# EAGLE design LED-zero35-SHIM (EAGLE 9.6.2)

## Sheet 1 of 2
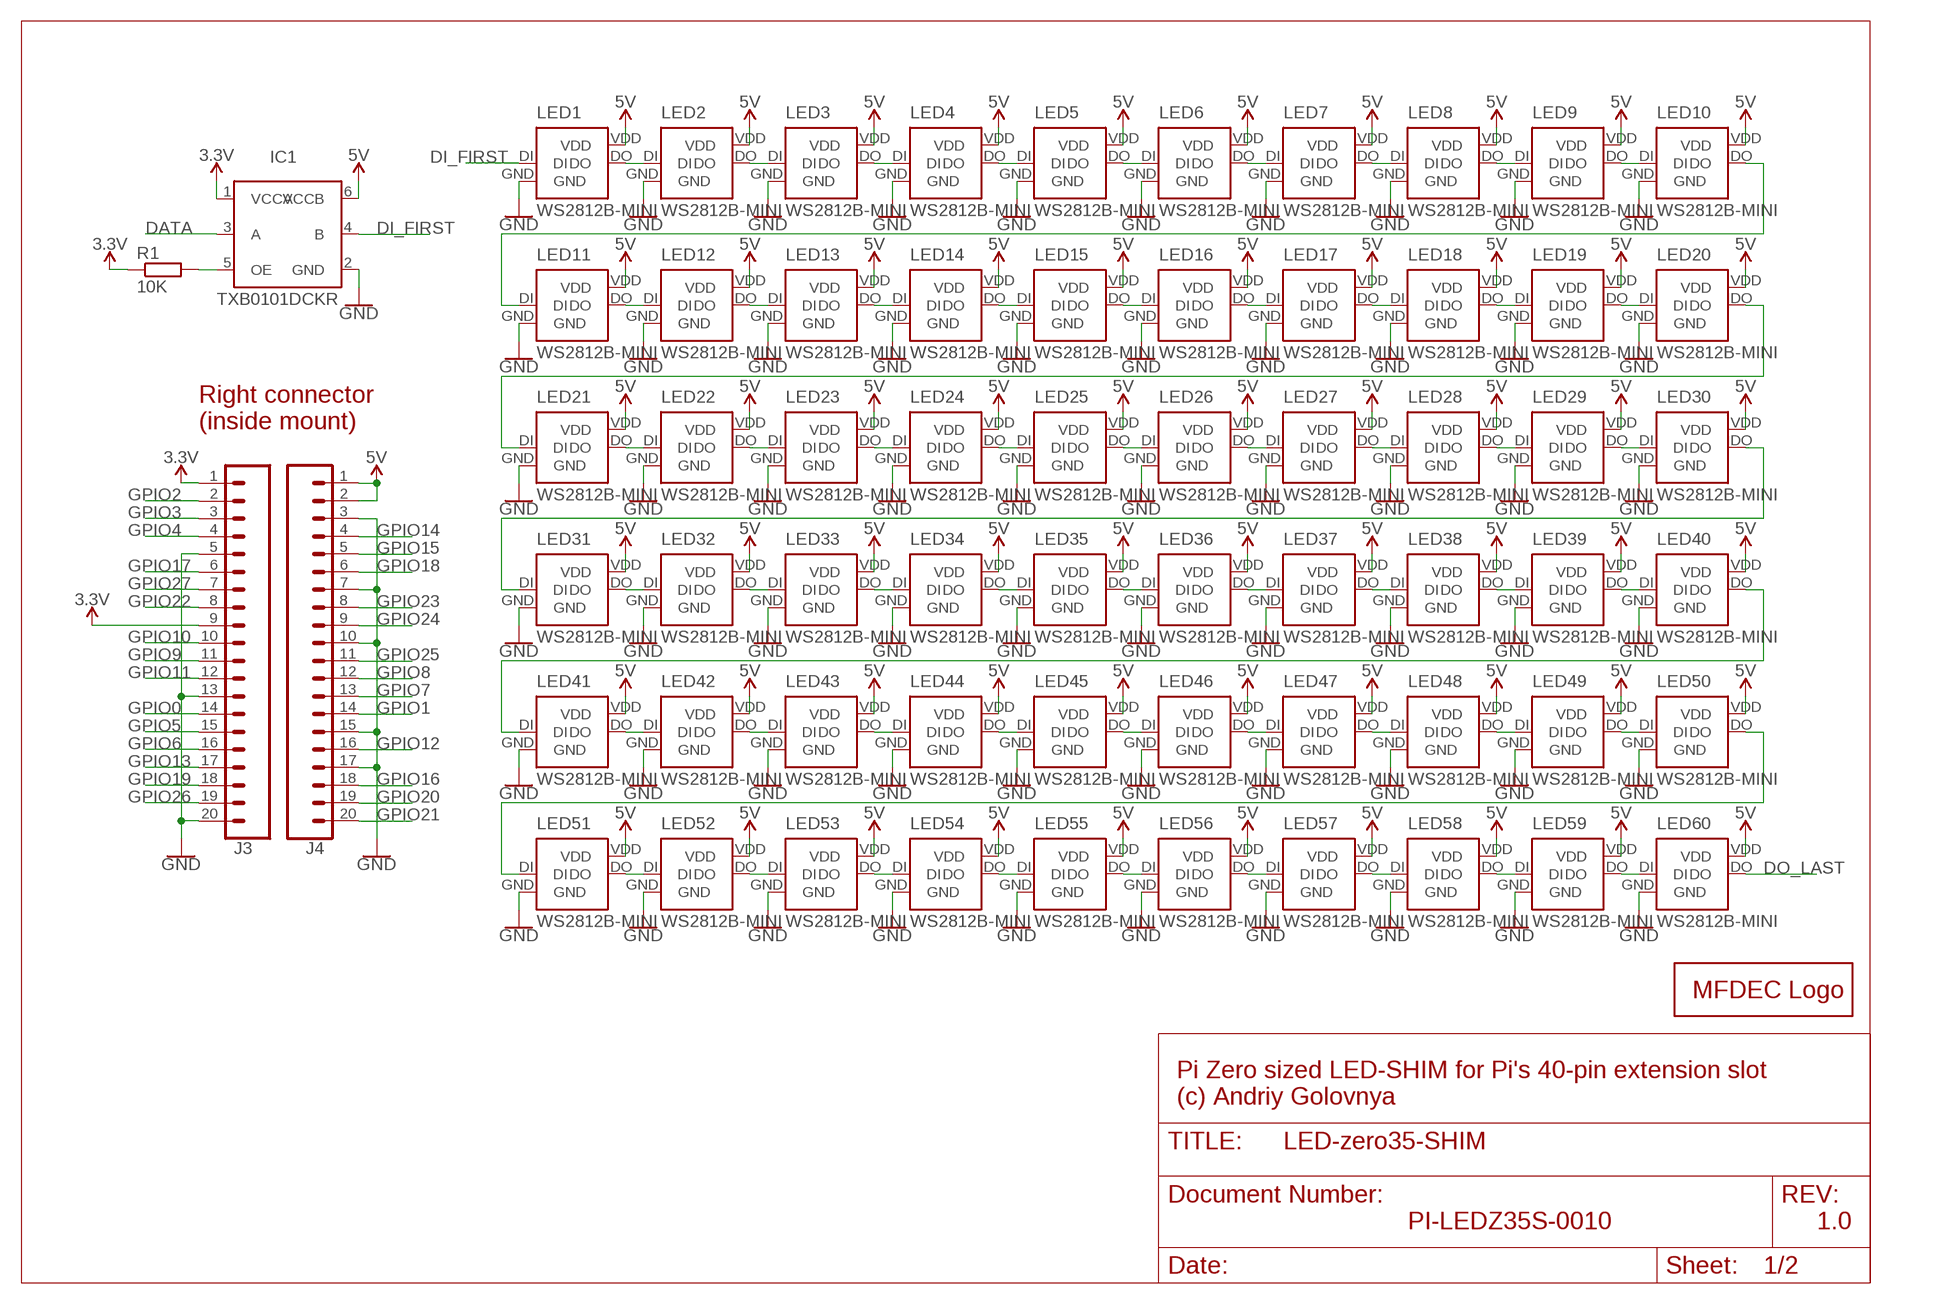
[diagram p0: schematic, sheet 1]

### Parts
IC1  TXB0101DCKR  [SOT65P210X110-6N]
J3  CONN_20LOCK  [1X20_LOCK]
J4  CONN_20LOCK  [1X20_LOCK]
LED1  WS2812B-MINI  [WS2812X-MINI]
LED2  WS2812B-MINI  [WS2812X-MINI]
LED3  WS2812B-MINI  [WS2812X-MINI]
LED4  WS2812B-MINI  [WS2812X-MINI]
LED5  WS2812B-MINI  [WS2812X-MINI]
LED6  WS2812B-MINI  [WS2812X-MINI]
LED7  WS2812B-MINI  [WS2812X-MINI]
LED8  WS2812B-MINI  [WS2812X-MINI]
LED9  WS2812B-MINI  [WS2812X-MINI]
LED10  WS2812B-MINI  [WS2812X-MINI]
LED11  WS2812B-MINI  [WS2812X-MINI]
LED12  WS2812B-MINI  [WS2812X-MINI]
LED13  WS2812B-MINI  [WS2812X-MINI]
LED14  WS2812B-MINI  [WS2812X-MINI]
LED15  WS2812B-MINI  [WS2812X-MINI]
LED16  WS2812B-MINI  [WS2812X-MINI]
LED17  WS2812B-MINI  [WS2812X-MINI]
LED18  WS2812B-MINI  [WS2812X-MINI]
LED19  WS2812B-MINI  [WS2812X-MINI]
LED20  WS2812B-MINI  [WS2812X-MINI]
LED21  WS2812B-MINI  [WS2812X-MINI]
LED22  WS2812B-MINI  [WS2812X-MINI]
LED23  WS2812B-MINI  [WS2812X-MINI]
LED24  WS2812B-MINI  [WS2812X-MINI]
LED25  WS2812B-MINI  [WS2812X-MINI]
LED26  WS2812B-MINI  [WS2812X-MINI]
LED27  WS2812B-MINI  [WS2812X-MINI]
LED28  WS2812B-MINI  [WS2812X-MINI]
LED29  WS2812B-MINI  [WS2812X-MINI]
LED30  WS2812B-MINI  [WS2812X-MINI]
LED31  WS2812B-MINI  [WS2812X-MINI]
LED32  WS2812B-MINI  [WS2812X-MINI]
LED33  WS2812B-MINI  [WS2812X-MINI]
LED34  WS2812B-MINI  [WS2812X-MINI]
LED35  WS2812B-MINI  [WS2812X-MINI]
LED36  WS2812B-MINI  [WS2812X-MINI]
LED37  WS2812B-MINI  [WS2812X-MINI]
LED38  WS2812B-MINI  [WS2812X-MINI]
LED39  WS2812B-MINI  [WS2812X-MINI]
LED40  WS2812B-MINI  [WS2812X-MINI]
LED41  WS2812B-MINI  [WS2812X-MINI]
LED42  WS2812B-MINI  [WS2812X-MINI]
LED43  WS2812B-MINI  [WS2812X-MINI]
LED44  WS2812B-MINI  [WS2812X-MINI]
LED45  WS2812B-MINI  [WS2812X-MINI]
LED46  WS2812B-MINI  [WS2812X-MINI]
LED47  WS2812B-MINI  [WS2812X-MINI]
LED48  WS2812B-MINI  [WS2812X-MINI]
LED49  WS2812B-MINI  [WS2812X-MINI]
LED50  WS2812B-MINI  [WS2812X-MINI]
LED51  WS2812B-MINI  [WS2812X-MINI]
LED52  WS2812B-MINI  [WS2812X-MINI]
LED53  WS2812B-MINI  [WS2812X-MINI]
LED54  WS2812B-MINI  [WS2812X-MINI]
LED55  WS2812B-MINI  [WS2812X-MINI]
LED56  WS2812B-MINI  [WS2812X-MINI]
LED57  WS2812B-MINI  [WS2812X-MINI]
LED58  WS2812B-MINI  [WS2812X-MINI]
LED59  WS2812B-MINI  [WS2812X-MINI]
LED60  WS2812B-MINI  [WS2812X-MINI]
LOGO1  MFDECLOGO_L_30MM  [MFDEC_L_30MM]
R1  10K  R-EU_R0402  [R0402]

### Nets
3.3V: IC1.1(VCCA) J3.1 J3.9 R1.1
5V: IC1.6(VCCB) J4.1 J4.2 LED1.VDD LED2.VDD LED3.VDD LED4.VDD LED5.VDD LED6.VDD LED7.VDD LED8.VDD LED9.VDD LED10.VDD LED11.VDD LED12.VDD LED13.VDD LED14.VDD LED15.VDD LED16.VDD LED17.VDD LED18.VDD LED19.VDD LED20.VDD LED21.VDD LED22.VDD LED23.VDD LED24.VDD LED25.VDD LED26.VDD LED27.VDD LED28.VDD LED29.VDD LED30.VDD LED31.VDD LED32.VDD LED33.VDD LED34.VDD LED35.VDD LED36.VDD LED37.VDD LED38.VDD LED39.VDD LED40.VDD LED41.VDD LED42.VDD LED43.VDD LED44.VDD LED45.VDD LED46.VDD LED47.VDD LED48.VDD LED49.VDD LED50.VDD LED51.VDD LED52.VDD LED53.VDD LED54.VDD LED55.VDD LED56.VDD LED57.VDD LED58.VDD LED59.VDD LED60.VDD ; also sheet 2
DATA: IC1.3(A) ; also sheet 2
DI_FIRST: IC1.4(B) LED1.DI ; also sheet 2
DO_LAST: LED60.DO ; also sheet 2
GND: IC1.2(GND) J3.5 J3.13 J3.20 J4.3 J4.7 J4.10 J4.15 J4.17 LED1.GND LED2.GND LED3.GND LED4.GND LED5.GND LED6.GND LED7.GND LED8.GND LED9.GND LED10.GND LED11.GND LED12.GND LED13.GND LED14.GND LED15.GND LED16.GND LED17.GND LED18.GND LED19.GND LED20.GND LED21.GND LED22.GND LED23.GND LED24.GND LED25.GND LED26.GND LED27.GND LED28.GND LED29.GND LED30.GND LED31.GND LED32.GND LED33.GND LED34.GND LED35.GND LED36.GND LED37.GND LED38.GND LED39.GND LED40.GND LED41.GND LED42.GND LED43.GND LED44.GND LED45.GND LED46.GND LED47.GND LED48.GND LED49.GND LED50.GND LED51.GND LED52.GND LED53.GND LED54.GND LED55.GND LED56.GND LED57.GND LED58.GND LED59.GND LED60.GND ; also sheet 2
GPIO0: J3.14
GPIO1: J4.14
GPIO2: J3.2
GPIO3: J3.3
GPIO4: J3.4
GPIO5: J3.15
GPIO6: J3.16
GPIO7: J4.13
GPIO8: J4.12
GPIO9: J3.11
GPIO10: J3.10 ; also sheet 2
GPIO11: J3.12
GPIO12: J4.16
GPIO13: J3.17
GPIO14: J4.4
GPIO15: J4.5
GPIO16: J4.18
GPIO17: J3.6
GPIO18: J4.6 ; also sheet 2
GPIO19: J3.18
GPIO20: J4.19
GPIO21: J4.20 ; also sheet 2
GPIO22: J3.8
GPIO23: J4.8
GPIO24: J4.9
GPIO25: J4.11
GPIO26: J3.19
GPIO27: J3.7
N$1: LED1.DO LED2.DI
N$2: LED2.DO LED3.DI
N$3: LED3.DO LED4.DI
N$4: LED4.DO LED5.DI
N$5: LED5.DO LED6.DI
N$6: LED6.DO LED7.DI
N$7: LED7.DO LED8.DI
N$8: LED8.DO LED9.DI
N$9: LED9.DO LED10.DI
N$10: LED10.DO LED11.DI
N$11: LED11.DO LED12.DI
N$12: LED12.DO LED13.DI
N$13: LED13.DO LED14.DI
N$14: LED14.DO LED15.DI
N$15: LED15.DO LED16.DI
N$16: LED16.DO LED17.DI
N$17: LED17.DO LED18.DI
N$18: LED18.DO LED19.DI
N$19: LED19.DO LED20.DI
N$20: LED20.DO LED21.DI
N$22: LED21.DO LED22.DI
N$23: LED22.DO LED23.DI
N$24: LED23.DO LED24.DI
N$25: LED24.DO LED25.DI
N$26: LED25.DO LED26.DI
N$27: LED26.DO LED27.DI
N$28: LED27.DO LED28.DI
N$29: LED28.DO LED29.DI
N$30: LED29.DO LED30.DI
N$31: LED30.DO LED31.DI
N$32: LED41.DO LED42.DI
N$33: LED31.DO LED32.DI
N$34: LED32.DO LED33.DI
N$35: LED33.DO LED34.DI
N$36: LED34.DO LED35.DI
N$37: LED35.DO LED36.DI
N$38: LED36.DO LED37.DI
N$39: LED37.DO LED38.DI
N$40: LED38.DO LED39.DI
N$41: LED39.DO LED40.DI
N$42: LED40.DO LED41.DI
N$43: LED42.DO LED43.DI
N$44: LED43.DO LED44.DI
N$45: LED44.DO LED45.DI
N$46: LED45.DO LED46.DI
N$47: LED46.DO LED47.DI
N$48: LED47.DO LED48.DI
N$49: LED48.DO LED49.DI
N$50: LED49.DO LED50.DI
N$51: LED50.DO LED51.DI
N$52: LED51.DO LED52.DI
N$53: LED52.DO LED53.DI
N$54: LED53.DO LED54.DI
N$55: LED54.DO LED55.DI
N$56: LED55.DO LED56.DI
N$57: LED56.DO LED57.DI
N$58: LED57.DO LED58.DI
N$59: LED58.DO LED59.DI
N$60: LED59.DO LED60.DI
N$143: IC1.5(OE) R1.2

### Notes on the sheet
- Right connector
  (inside mount)
- Pi Zero sized LED-SHIM for Pi's 40-pin extension slot
  (c) Andriy Golovnya
- PI-LEDZ35S-0010 | 1.0

## Sheet 2 of 2
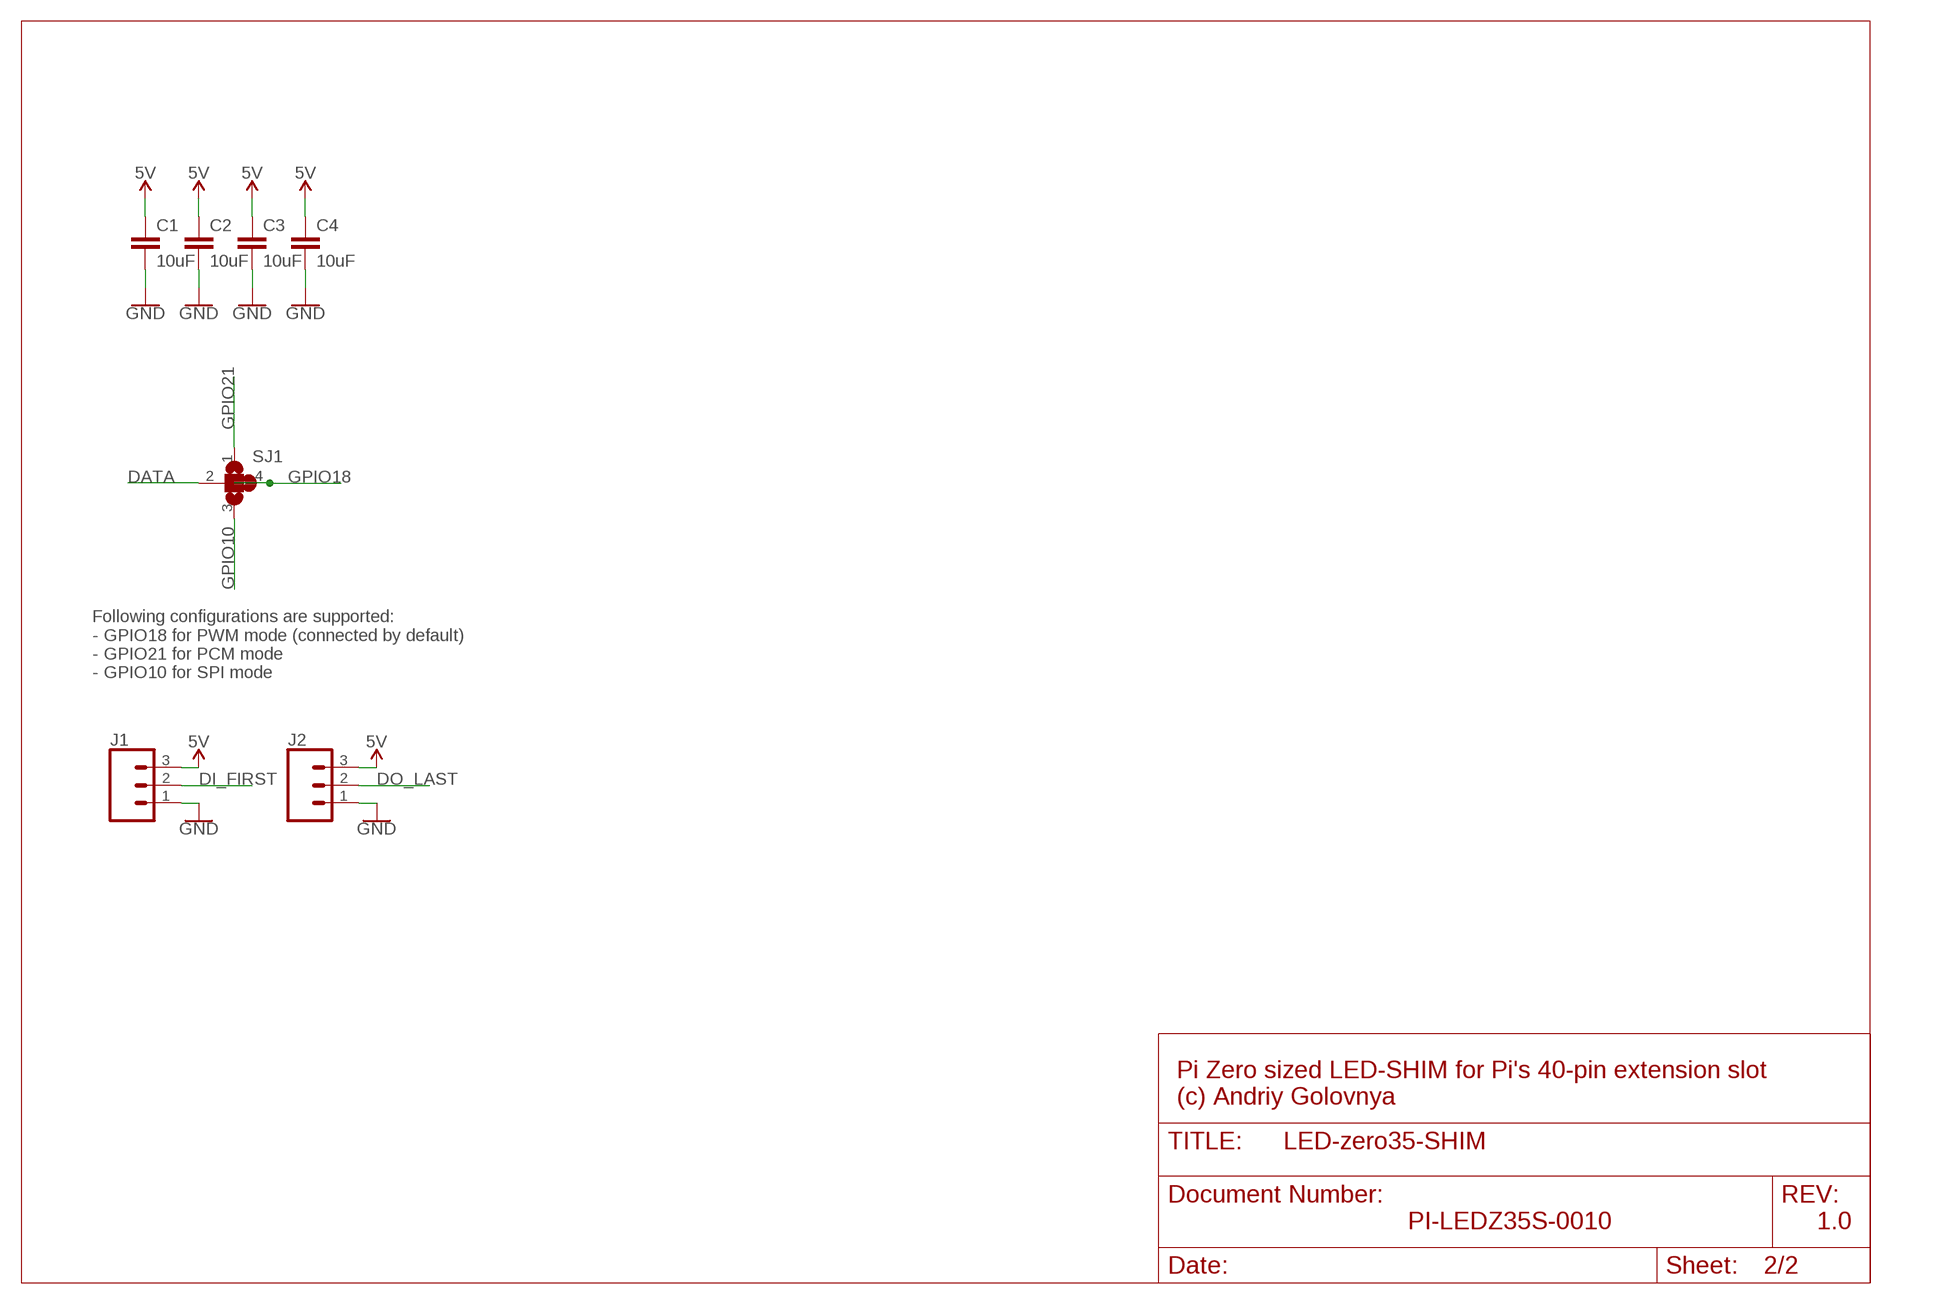
[diagram p1: schematic, sheet 2]

### Parts
C1  10uF  C-EUC0805  [C0805]
C2  10uF  C-EUC0805  [C0805]
C3  10uF  C-EUC0805  [C0805]
C4  10uF  C-EUC0805  [C0805]
J1  CONN_03  [1X03]
J2  CONN_03  [1X03]
SJ1  SJ3  [SJ_3]

### Nets
5V: C1.1 C2.1 C3.1 C4.1 J1.3 J2.3 ; also sheet 1
DATA: SJ1.2 ; also sheet 1
DI_FIRST: J1.2 ; also sheet 1
DO_LAST: J2.2 ; also sheet 1
GND: C1.2 C2.2 C3.2 C4.2 J1.1 J2.1 ; also sheet 1
GPIO10: SJ1.3 ; also sheet 1
GPIO18: SJ1.4 ; also sheet 1
GPIO21: SJ1.1 ; also sheet 1

### Notes on the sheet
- Following configurations are supported:
  - GPIO18 for PWM mode (connected by default)
  - GPIO21 for PCM mode
  - GPIO10 for SPI mode
- Pi Zero sized LED-SHIM for Pi's 40-pin extension slot
  (c) Andriy Golovnya
- PI-LEDZ35S-0010 | 1.0

## Library data of the parts
C1-C4 = rcl:C-EU: CAPACITOR, European symbol; SPICEPREFIX: C
IC1 = TXB0101DCKR:TXB0101DCKR
J1 J2 = SparkFun-Connectors:CONN_03: Multi connection point. Often used as Generic Header-pin footprint for 0.1 inch spaced/style header connections On any of the 0.1 inch spaced packages, you can populate with these: Break Away Headers - Straight <https://www.sparkfun.com/products/116> (PRT-00116) Break Away Male Headers - Right Angle <https://www.sparkfun.com/products/553> (PRT-00553) Female Headers <https://www.sparkfun.com/products/115> (PRT-00115) Break Away Headers - Machine Pin <https://www.sparkfun.com/products/117> (PRT-00117) Break Away Female Headers - Swiss Machine Pin <https://www.sparkfun.com/products/743> (PRT-00743) Stackable Header - 3 Pin (Female, 0.1") <https://www.sparkfun.com/products/13875> (PRT-13875) For SCREWTERMINALS and SPRING TERMINALS visit here: Screw Terimnals on SparkFun.com <https://www.sparkfun.com/search/results?term=Screw+Terminals> (5mm/3.5mm/2.54mm spacing) This device is also useful as a general connection point to wire up your design to another part of your project. Our various solder wires solder well into these plated through hole pads. Hook-Up Wire - Assortment (Stranded, 22 AWG) <https://www.sparkfun.com/products/11375> (PRT-11375) Hook-Up Wire - Assortment (Solid Core, 22 AWG) <https://www.sparkfun.com/products/11367> (PRT-11367) View the entire wire category on our website here <https://www.sparkfun.com/categories/141> Special notes: Molex polarized connector foot print use with SKU : PRT-08232 with associated crimp pins and housings.
J3 J4 = _my_locked_connectors:CONN_20: Multi connection point. Often used as Generic Header-pin footprint for 0.1 inch spaced/style header connections On any of the 0.1 inch spaced packages, you can populate with these: Break Away Headers - Straight <https://www.sparkfun.com/products/116> (PRT-00116) Break Away Male Headers - Right Angle <https://www.sparkfun.com/products/553> (PRT-00553) Female Headers <https://www.sparkfun.com/products/115> (PRT-00115) Break Away Headers - Machine Pin <https://www.sparkfun.com/products/117> (PRT-00117) Break Away Female Headers - Swiss Machine Pin <https://www.sparkfun.com/products/743> (PRT-00743) For SCREWTERMINALS and SPRING TERMINALS visit here: Screw Terimnals on SparkFun.com <https://www.sparkfun.com/search/results?term=Screw+Terminals> (5mm/3.5mm/2.54mm spacing) This device is also useful as a general connection point to wire up your design to another part of your project. Our various solder wires solder well into these plated through hole pads. Hook-Up Wire - Assortment (Stranded, 22 AWG) <https://www.sparkfun.com/products/11375> (PRT-11375) Hook-Up Wire - Assortment (Solid Core, 22 AWG) <https://www.sparkfun.com/products/11367> (PRT-11367) View the entire wire category on our website here <https://www.sparkfun.com/categories/141> Special notes: Molex polarized connector foot print use with SKU : PRT-08231 with associated crimp pins and housings. 1MM SMD Version SKU: PRT-10208 NOTES ON THE VARIANTS LOCK and LOCK_LONGPADS... This footprint was designed to help hold the alignment of a through-hole component (i.e. 6-pin header) while soldering it into place. You may notice that each hole has been shifted either up or down by 0.005 of an inch from it's more standard position (which is a perfectly straight line). This slight alteration caused the pins (the squares in the middle) to touch the edges of the holes. Because they are alternating, it causes a "brace" to hold the component in place. 0.005 has proven to be the perfect amount of "off-center" position when using our standard breakaway headers. Although looks a little odd when you look at the bare footprint, once you have a header in there, the alteration is very hard to notice. Also,if you push a header all the way into place, it is covered up entirely on the bottom side. Note about LOCK SPECIAL package: This is just like the LOCK variant in that the holes are staggared by 5 mil, but except for the last two holes. They are not altered from the "standard" footprint layout. This is used for a special purpose on the layout of our Graphic LCD Backpack. Make sure you want to use this device before selecting it for you project!
LED1-LED60 = WS281X:WS2812: WS2812 RGB LED
LOGO1 = _my_logos:MFDECLOGO: Midnight Fog - Digital Eye Candy LOGO
R1 = rcl:R-EU_: RESISTOR, European symbol; SPICEPREFIX: R
SJ1 = _my_jumpers:SJ3: SMD solder JUMPER SJ3 - simple jumper SJ3FI - fancy inside jumper SJ3FO - fancy outside jumper SJ3W - wide jumper

## Board
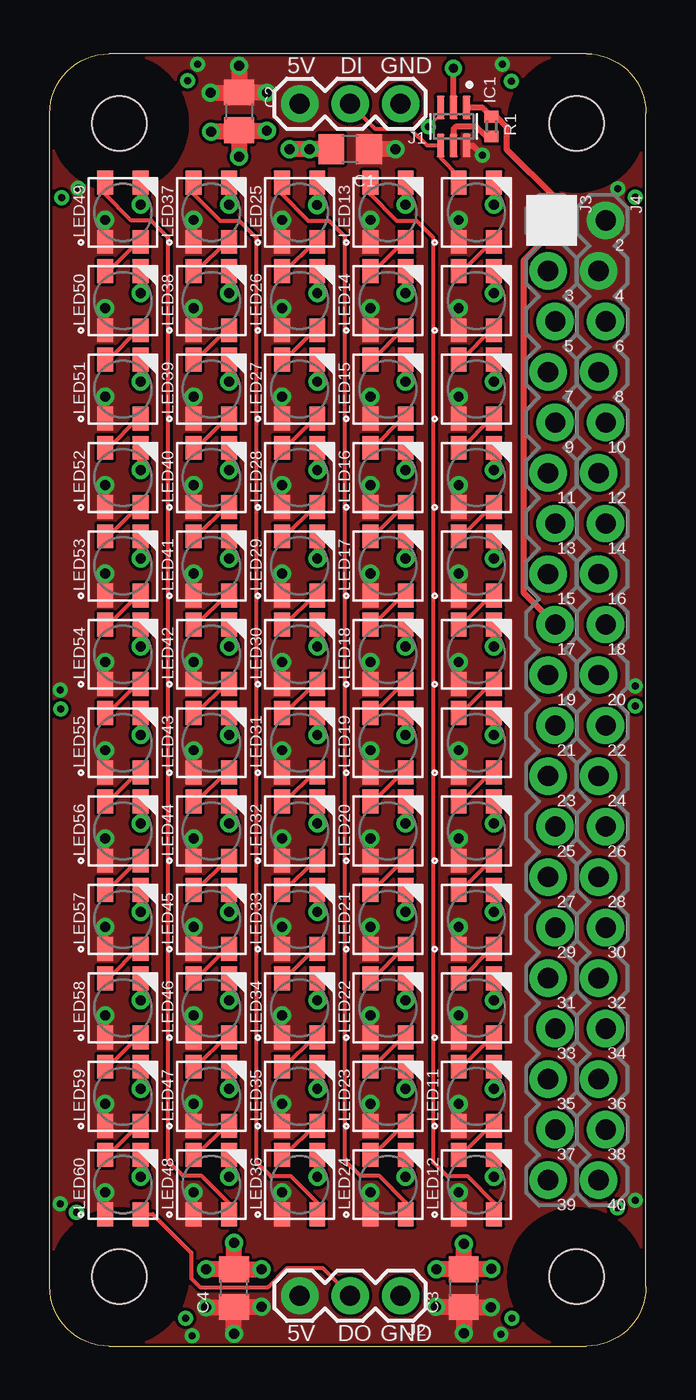
[diagram p2: board, top side]
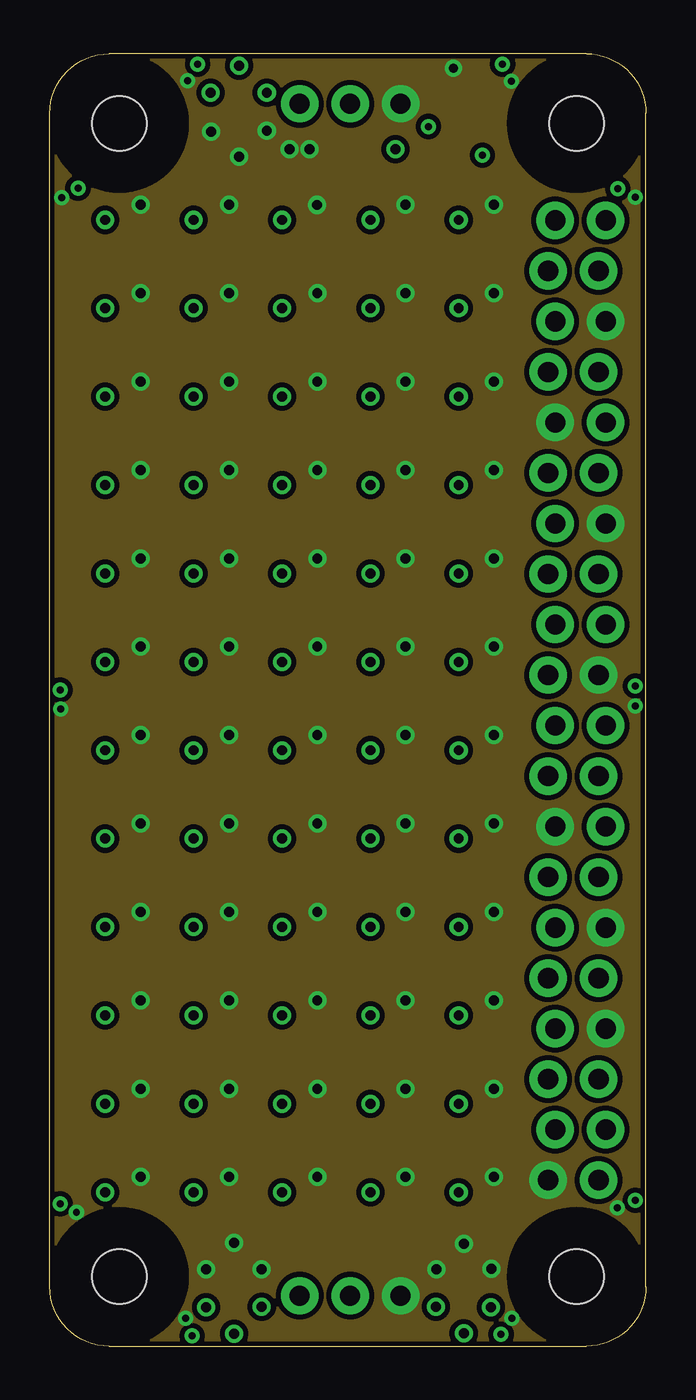
[diagram p3: board, inner layer Route2]
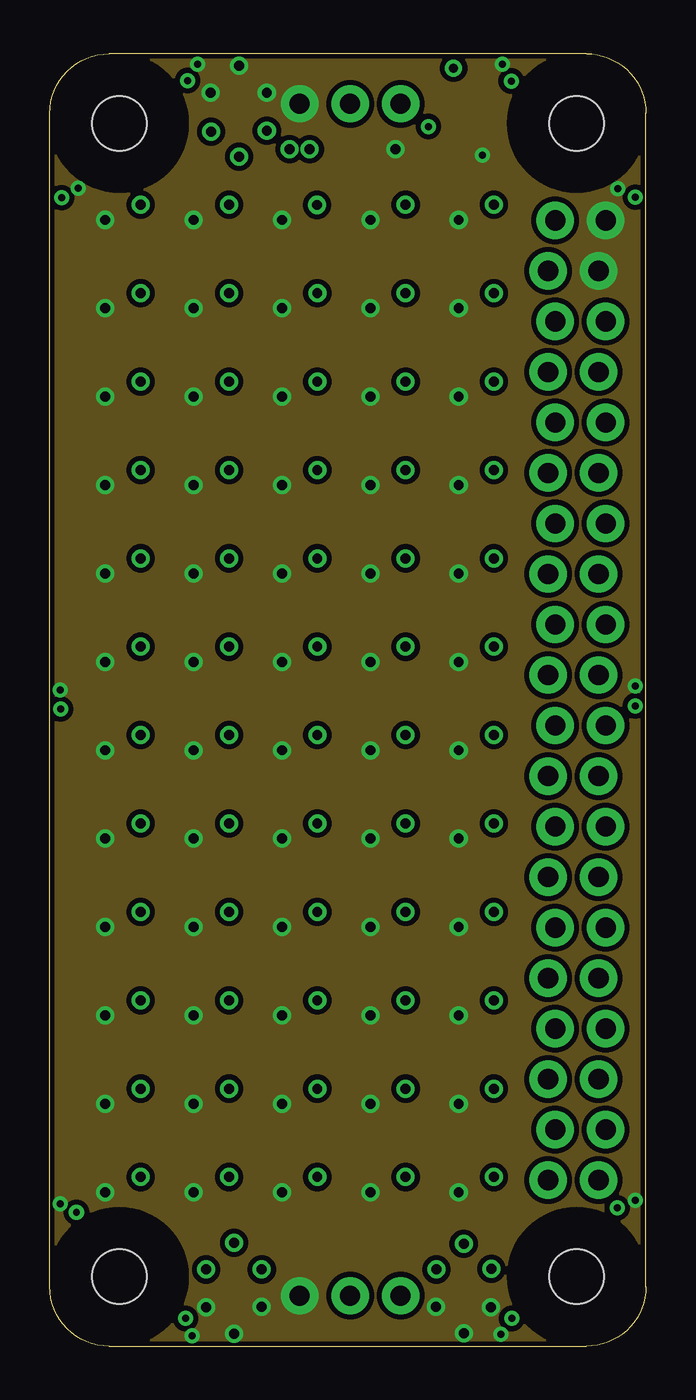
[diagram p4: board, inner layer Route15]
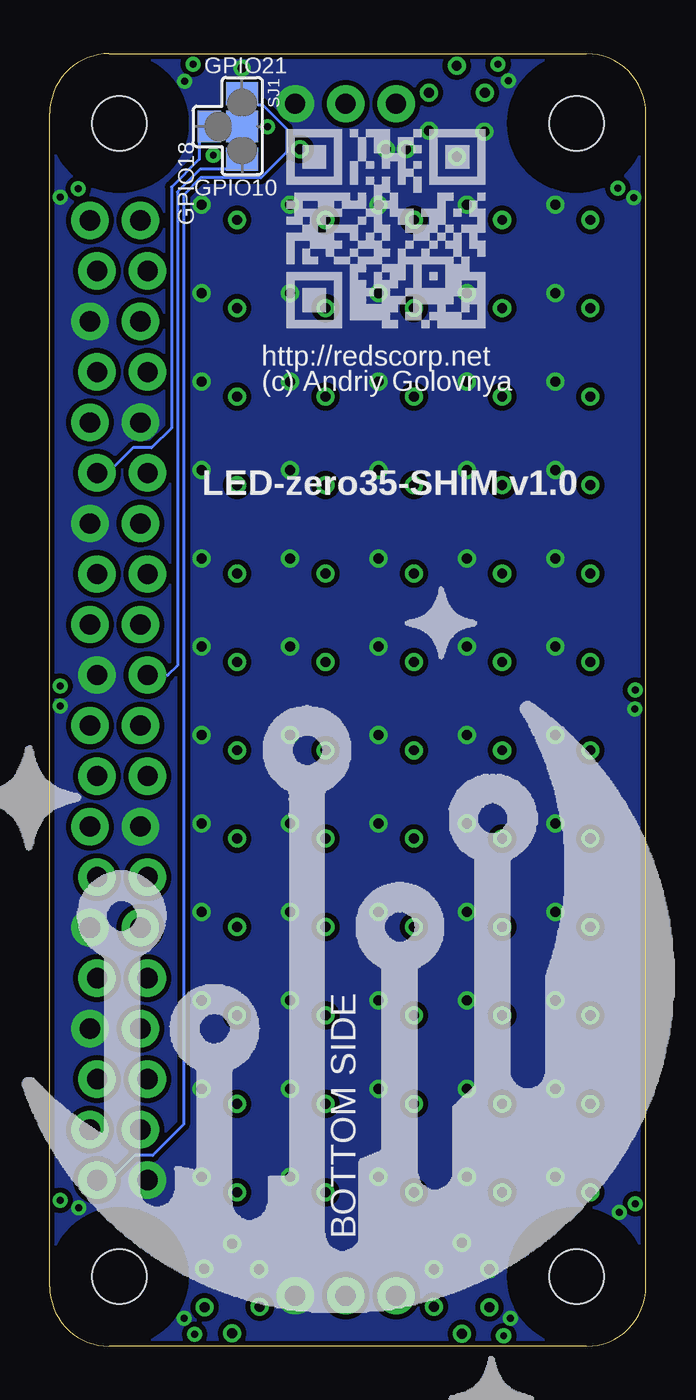
[diagram p5: board, bottom side, seen from below]

Size 30 x 65 mm. Coordinates in mm from the lower left corner, seen from the top.
Outline: 0,3 arc90 3,0 27,0 arc90 30,3 30,62 arc90 27,65 3,65 arc90 0,62
Outline: 0,3 arc0 0,3
Outline: 0,62 arc0 0,62
Outline: 0,3 0,62
Copper layers (1+2*15+16): Top 0.035mm / dielectric 0.2mm / Route2 0.035mm / dielectric 1.5mm / Route15 0.035mm / dielectric 0.2mm / Bottom 0.035mm
Design rules "default *": minimum track width 6mil, minimum drill 0.35mm, track to track 6mil, track to pad 6mil, pad to pad 6mil, via to via 6mil, smd to smd 6mil, copper to edge 6mil, drill to drill 6mil, minimum pad ring 10mil, minimum via ring 8mil, stop-mask expansion 4mil, vias tented up to drill 20mil, thermal gap 10mil
Holes 2.75 mm at 3.5,3.5 26.5,3.5 3.5,61.5 26.5,61.5

### Footprints (pad centres in the part's own frame; a part is rotated, then mirrored left to right if it is on the bottom)
C0805 = smd 1.3 x 1.5: 1 -0.95,0; 2 0.95,0
SOT65P210X110-6N = smd 1.19 x 0.4: 1 -0.96,0.65; 2 -0.96,0; 3 -0.96,-0.65; 4 0.96,-0.65; 5 0.96,0; 6 0.96,0.65
1X03 = drill 1.016 pad 1.88: 1 0,0; 2 2.54,0; 3 5.08,0
1X20_LOCK = drill 1.016 pad 1.88: 1 0,0.178; 2 2.54,-0.178; 3 5.08,0.178; 4 7.62,-0.178; 5 10.16,0.178; 6 12.7,-0.178; 7 15.24,0.178; 8 17.78,-0.178; 9 20.32,0.178; 10 22.86,-0.178; 11 25.4,0.178; 12 27.94,-0.178; 13 30.48,0.178; 14 33.02,-0.178; 15 35.56,0.178; 16 38.1,-0.178; 17 40.64,0.178; 18 43.18,-0.178; 19 45.72,0.178; 20 48.26,-0.178
WS2812X-MINI = smd 1.2 x 0.8: DI 1.49,0.89; DO -1.49,-0.89; GND 1.49,-0.89; VDD -1.49,0.89
R0402 = smd 0.6 x 0.7: 1 -0.5,0; 2 0.5,0
SJ_3 = smd 1.168 x 1.6: 1 -1.651,0; 3 1.651,0 | smd 1.6 x 1.6: 2 0,0 | smd 1.6 x 1.168: 4 0,-1.651

### Placement (x,y rotation side)
C1  15.11,60.2 180 top
C2  9.53,62.1 270 top
C3  20.83,2.92 90 top
C4  9.27,2.92 90 top
IC1  20.32,61.34 270 top
J1  17.65,62.48 180 top
J2  17.65,2.54 180 top
J3  25.25,56.62 270 top
J4  27.79,56.62 270 top
LED1  21.46,57.02 90 top
LED2  21.46,52.58 90 top
LED3  21.46,48.13 90 top
LED4  21.46,43.69 90 top
LED5  21.46,39.24 90 top
LED6  21.46,34.8 90 top
LED7  21.46,30.35 90 top
LED8  21.46,25.91 90 top
LED9  21.46,21.46 90 top
LED10  21.46,17.02 90 top
LED11  21.46,12.57 90 top
LED12  21.46,8.13 90 top
LED13  17.02,57.02 90 top
LED14  17.02,52.58 90 top
LED15  17.02,48.13 90 top
LED16  17.02,43.69 90 top
LED17  17.02,39.24 90 top
LED18  17.02,34.8 90 top
LED19  17.02,30.35 90 top
LED20  17.02,25.91 90 top
LED21  17.02,21.46 90 top
LED22  17.02,17.02 90 top
LED23  17.02,12.57 90 top
LED24  17.02,8.13 90 top
LED25  12.57,57.02 90 top
LED26  12.57,52.58 90 top
LED27  12.57,48.13 90 top
LED28  12.57,43.69 90 top
LED29  12.57,39.24 90 top
LED30  12.57,34.8 90 top
LED31  12.57,30.35 90 top
LED32  12.57,25.91 90 top
LED33  12.57,21.46 90 top
LED34  12.57,17.02 90 top
LED35  12.57,12.57 90 top
LED36  12.57,8.13 90 top
LED37  8.13,57.02 90 top
LED38  8.13,52.58 90 top
LED39  8.13,48.13 90 top
LED40  8.13,43.69 90 top
LED41  8.13,39.24 90 top
LED42  8.13,34.8 90 top
LED43  8.13,30.35 90 top
LED44  8.13,25.91 90 top
LED45  8.13,21.46 90 top
LED46  8.13,17.02 90 top
LED47  8.13,12.57 90 top
LED48  8.13,8.13 90 top
LED49  3.68,57.02 90 top
LED50  3.68,52.58 90 top
LED51  3.68,48.13 90 top
LED52  3.68,43.69 90 top
LED53  3.68,39.24 90 top
LED54  3.68,34.8 90 top
LED55  3.68,30.35 90 top
LED56  3.68,25.91 90 top
LED57  3.68,21.46 90 top
LED58  3.68,17.02 90 top
LED59  3.68,12.57 90 top
LED60  3.68,8.13 90 top
LOGO1  -4.19,-7.11 90 bottom  (outside the outline)
LOGO3  RSNURL_QR_10MM  [RSNURL_QR_10MM]  18.09,51.21 0 bottom
R1  22.23,61.34 270 top
SJ1  20.32,61.34 270 bottom

### Tracks (layer width: path | path; a pad name or v marks a point on that pad's centre or on a via)
3.3V
  Top 0.305: IC1.1 21.77,62.3 R1.1 22.49,61.84 22.99,61.34 22.99,60.2 25.43,57.75 J3.1 25.43,56.19 23.83,54.59 23.83,37.9 J3.9
5V  (via drill 0.35, 0.5)
  Top 0.305: IC1.6 21.28,60.38 v21.77,59.89
  Top 0.406: LED1.VDD v20.57,56.64 | LED2.VDD v20.57,52.2 | LED3.VDD v20.57,47.75 | LED4.VDD v20.57,43.31 | LED5.VDD v20.57,38.86 | LED6.VDD v20.57,34.42 | LED7.VDD v20.57,29.97 | LED8.VDD v20.57,25.53 | LED9.VDD v20.57,21.08 | LED10.VDD v20.57,16.64 | LED11.VDD v20.57,12.19 | LED12.VDD v20.57,7.75 | LED13.VDD v16.13,56.64 | LED25.VDD v11.68,56.64 | LED37.VDD v7.24,56.64 | LED49.VDD v2.79,56.64 | LED50.VDD v2.79,52.2 | LED38.VDD v7.24,52.2 | LED26.VDD v11.68,52.2 | LED14.VDD v16.13,52.2 | LED15.VDD v16.13,47.75 | LED27.VDD v11.68,47.75 | LED39.VDD v7.24,47.75 | LED51.VDD v2.79,47.75 | LED52.VDD v2.79,43.31 | LED40.VDD v7.24,43.31 | LED28.VDD v11.68,43.31 | LED16.VDD v16.13,43.31 | LED17.VDD v16.13,38.86 | LED29.VDD v11.68,38.86 | LED41.VDD v7.24,38.86 | LED53.VDD v2.79,38.86 | LED54.VDD v2.79,34.42 | LED42.VDD v7.24,34.42 | LED30.VDD v11.68,34.42 | LED18.VDD v16.13,34.42 | LED19.VDD v16.13,29.97 | LED31.VDD v11.68,29.97 | LED43.VDD v7.24,29.97 | LED55.VDD v2.79,29.97 | LED56.VDD v2.79,25.53 | LED44.VDD v7.24,25.53 | LED32.VDD v11.68,25.53 | LED20.VDD v16.13,25.53 | LED21.VDD v16.13,21.08 | LED33.VDD v11.68,21.08 | LED45.VDD v7.24,21.08 | LED57.VDD v2.79,21.08 | LED58.VDD v2.79,16.64 | LED46.VDD v7.24,16.64 | LED34.VDD v11.68,16.64 | LED22.VDD v16.13,16.64 | LED23.VDD v16.13,12.19 | LED35.VDD v11.68,12.19 | LED47.VDD v7.24,12.19 | LED59.VDD v2.79,12.19 | LED60.VDD v2.79,7.75 | LED24.VDD v16.13,7.75 | LED36.VDD v11.68,7.75 | LED48.VDD v7.24,7.75
  Top 0.813: C3.1 v19.44,1.97 v19.43,1.98 | C3.1 v20.83,0.66 | C3.1 22.18,1.97 v22.2,1.96 | v10.92,63.04 C2.1 | v9.53,64.39 C2.1 | v8.1,63.04 9.52,63.04 C2.1 | v7.87,1.96 9.26,1.96 | 9.26,1.96 C4.1 10.66,1.97 v10.67,1.98 | v9.27,0.64 9.26,0.65 9.26,1.96 | v17.4,60.2 C1.1 16.32,59.94
  other vias: 22.78,64.47 28.58,58.22 7.44,64.47 1.42,58.24 0.53,7.16 7.16,0.53 29.46,7.34 22.71,0.61 0.53,32.99 29.46,33.2
  pour Route15 (isolate 0.254, no thermals): 0,-3.81 0,65.15 30.23,65.15 30.23,-3.81
  pour Top (no thermals): 30.23,0 -3.81,0 -3.81,65.15 30.23,65.15
DATA  (via drill 0.35)
  Top 0.152: v19.05,61.34 19.67,61.96 IC1.3
  Bottom 0.152: SJ1.2 v19.05,61.34
DI_FIRST
  Top 0.203: J1.2 16.38,61.21 18.16,61.21 18.99,60.38 IC1.4 19.67,59.76 20.57,58.85 LED1.DI
DO_LAST
  Top 0.203: LED60.DO 5.18,6.64 7.12,4.71 7.12,3.42 7.56,2.97 10.98,2.97 11.95,3.94 13.72,3.94 J2.2
GND  (via drill 0.35, 0.45, 0.5)
  Top 0.305: IC1.2 v20.32,64.26
  Top 0.406: LED1.GND v22.35,57.41 v22.35,57.4 | LED2.GND v22.35,52.96 | LED3.GND v22.35,48.52 v22.35,48.51 | LED4.GND v22.35,44.07 | LED5.GND v22.35,39.62 | LED6.GND v22.35,35.18 | LED7.GND v22.35,30.73 | LED8.GND v22.35,26.29 | LED9.GND v22.35,21.84 | LED10.GND v22.35,17.4 | LED11.GND v22.35,12.96 v22.35,12.95 | LED12.GND v22.35,8.51 | LED13.GND v17.91,57.41 v17.91,57.4 | LED25.GND 13.46,57.41 v13.45,57.4 | LED37.GND v9.02,57.41 v9.02,57.4 | LED49.GND v4.57,57.41 v4.57,57.4 | LED50.GND v4.57,52.96 | LED38.GND v9.02,52.96 | LED26.GND v13.46,52.96 | LED14.GND v17.91,52.96 | LED15.GND v17.91,48.52 v17.91,48.51 | LED27.GND v13.46,48.52 v13.46,48.51 | LED39.GND v9.02,48.52 v9.02,48.51 | LED51.GND v4.57,48.52 v4.57,48.51 | LED52.GND v4.57,44.07 | LED40.GND v9.02,44.07 | LED28.GND v13.46,44.07 | LED16.GND v17.91,44.07 | LED17.GND v17.91,39.62 | LED29.GND v13.46,39.62 | LED41.GND v9.02,39.62 | LED53.GND v4.57,39.62 | LED54.GND v4.57,35.18 | LED42.GND v9.02,35.18 | LED30.GND v13.46,35.18 | LED18.GND v17.91,35.18 | LED19.GND v17.91,30.73 | LED31.GND v13.46,30.73 | LED43.GND v9.02,30.73 | LED55.GND v4.57,30.73 | LED56.GND v4.57,26.29 | LED44.GND v9.02,26.29 | LED32.GND v13.46,26.29 | LED20.GND v17.91,26.29 | LED21.GND v17.91,21.84 | LED33.GND v13.46,21.84 | LED45.GND v9.02,21.84 | LED57.GND v4.57,21.84 | LED58.GND v4.57,17.4 | LED46.GND v9.02,17.4 | LED34.GND v13.46,17.4 | LED22.GND v17.91,17.4 | LED23.GND v17.91,12.96 v17.91,12.95 | LED35.GND v13.46,12.96 v13.46,12.95 | LED47.GND v9.02,12.96 v9.02,12.95 | LED59.GND v4.57,12.96 v4.57,12.95 | LED60.GND v4.57,8.51 | LED24.GND v17.91,8.51 | LED36.GND v13.46,8.51 | LED48.GND v9.02,8.51
  Top 0.813: C2.2 v9.53,59.82 | C2.2 9.54,61.14 v10.92,61.14 | C2.2 9.46,61.09 v8.13,61.09 | C4.2 7.88,3.87 v7.87,3.86 | C4.2 10.66,3.87 v10.67,3.86 | C4.2 v9.27,5.21 | C3.2 19.47,3.87 v19.46,3.86 | C3.2 20.84,3.89 v22.23,3.89 | C3.2 v20.83,5.16 | C1.2 v13.08,60.2 v12.07,60.2
  other vias: 6.93,63.65 0.61,57.76 23.22,63.63 29.46,57.78 28.55,6.96 23.24,1.4 6.83,1.4 1.35,6.73 29.46,32.21 0.56,32.05
  pour Bottom (isolate 0.254, no thermals): 0,0 0,65.15 34.54,65.15 34.54,0
  pour Route2 (isolate 0.254, no thermals): 0,0 30.23,0 30.23,68.71 0,68.71
GND1
  cutout Top: 26.5,0 arc-180 26.5,7 arc-180
  cutout Route2: 26.5,0 arc-180 26.5,7 arc-180
  cutout Route15: 26.5,0 arc-180 26.5,7 arc-180
  cutout Bottom: 26.5,0 arc-180 26.5,7 arc-180
GND3
  cutout Top: 3.5,58 arc-180 3.5,65 arc-180
  cutout Route2: 3.5,58 arc-180 3.5,65 arc-180
  cutout Route15: 3.5,58 arc-180 3.5,65 arc-180
  cutout Bottom: 3.5,58 arc-180 3.5,65 arc-180
GND4
  cutout Top: 26.5,58 arc-180 26.5,65 arc-180
  cutout Route2: 26.5,58 arc-180 26.5,65 arc-180
  cutout Route15: 26.5,58 arc-180 26.5,65 arc-180
  cutout Bottom: 26.5,58 arc-180 26.5,65 arc-180
GND5
  cutout Top: 3.5,0 arc-180 3.5,7 arc-180
  cutout Route2: 3.5,0 arc-180 3.5,7 arc-180
  cutout Route15: 3.5,0 arc-180 3.5,7 arc-180
  cutout Bottom: 3.5,0 arc-180 3.5,7 arc-180
GPIO10
  Bottom 0.152: SJ1.3 20.53,59.69 21.04,59.19 22.43,59.19 23.57,58.05 23.57,34.24 24.06,33.76 J3.10
GPIO18
  Bottom 0.152: J4.6 27.08,43.91 25.81,45.19 24.87,45.19 23.88,46.18 23.88,58.29 22.48,59.69 22.48,60.71 21.97,61.21 SJ1.4 20.84,61.34
GPIO21
  Bottom 0.152: SJ1.1 20.07,62.99 19.52,62.45 19.3,62.45 18.09,61.24 18.09,60.04 19.38,58.75 22.4,58.75 23.27,57.89 23.27,11.15 24.82,9.6 25.74,9.6 26.98,8.36 J4.20
N$1
  Top 0.203: LED1.DO 22.23,55.53 20.76,54.07 LED2.DI
N$2
  Top 0.203: LED2.DO 22.2,51.09 20.74,49.62 LED3.DI
N$3
  Top 0.203: LED3.DO 22.2,46.64 20.74,45.18 LED4.DI
N$4
  Top 0.203: LED4.DO 22.2,42.2 20.74,40.73 LED5.DI
N$5
  Top 0.203: LED5.DO 22.2,37.75 20.74,36.29 LED6.DI
N$6
  Top 0.203: LED6.DO 22.18,33.31 20.71,31.84 LED7.DI
N$7
  Top 0.203: LED7.DO 22.2,28.86 20.74,27.4 LED8.DI
N$8
  Top 0.203: LED8.DO 22.18,24.42 20.71,22.95 LED9.DI
N$9
  Top 0.203: LED9.DO 22.2,19.97 20.74,18.51 LED10.DI
N$10
  Top 0.203: LED10.DO 22.23,15.53 20.76,14.06 LED11.DI
N$11
  Top 0.203: LED11.DO 22.18,11.08 20.71,9.62 LED12.DI
N$12
  Top 0.203: LED12.DO 22.35,7.22 21.04,8.53 20.02,8.53 19.3,9.25 19.3,55.75 18.46,56.59 17.47,56.59 16.13,57.93 LED13.DI
N$13
  Top 0.203: LED13.DO 17.77,55.53 16.31,54.07 LED14.DI
N$14
  Top 0.203: LED14.DO 17.73,51.09 16.27,49.62 LED15.DI
N$15
  Top 0.203: LED15.DO 17.73,46.64 16.27,45.18 LED16.DI
N$16
  Top 0.203: LED16.DO 17.76,42.2 16.29,40.73 LED17.DI
N$17
  Top 0.203: LED17.DO 17.76,37.75 16.29,36.29 LED18.DI
N$18
  Top 0.203: LED18.DO 17.76,33.31 16.29,31.84 LED19.DI
N$19
  Top 0.203: LED19.DO 17.76,28.86 16.29,27.4 LED20.DI
N$20
  Top 0.203: LED20.DO 17.76,24.42 16.29,22.95 LED21.DI
N$22
  Top 0.203: LED21.DO 17.76,19.97 16.29,18.51 LED22.DI
N$23
  Top 0.203: LED22.DO 17.76,15.53 16.29,14.06 LED23.DI
N$24
  Top 0.203: LED23.DO 17.76,11.08 16.29,9.62 LED24.DI
N$25
  Top 0.203: LED24.DO 17.91,7.25 16.6,8.56 15.62,8.56 14.86,9.32 14.86,55.8 14.07,56.59 13.03,56.59 11.68,57.94 LED25.DI
N$26
  Top 0.203: LED25.DO 13.31,55.53 11.85,54.07 LED26.DI
N$27
  Top 0.203: LED26.DO 13.31,51.09 11.85,49.62 LED27.DI
N$28
  Top 0.203: LED27.DO 13.31,46.64 11.85,45.18 LED28.DI
N$29
  Top 0.203: LED28.DO 13.31,42.2 11.85,40.73 LED29.DI
N$30
  Top 0.203: LED29.DO 13.31,37.75 11.85,36.29 LED30.DI
N$31
  Top 0.203: LED30.DO 13.31,33.31 11.85,31.84 LED31.DI
N$32
  Top 0.203: LED41.DO 8.87,37.75 7.4,36.29 LED42.DI
N$33
  Top 0.203: LED31.DO 13.31,28.86 11.85,27.4 LED32.DI
N$34
  Top 0.203: LED32.DO 13.31,24.42 11.85,22.95 LED33.DI
N$35
  Top 0.203: LED33.DO 13.31,19.97 11.85,18.51 LED34.DI
N$36
  Top 0.203: LED34.DO 13.29,15.53 11.82,14.06 LED35.DI
N$37
  Top 0.203: LED35.DO 13.31,11.08 11.85,9.62 LED36.DI
N$38
  Top 0.203: LED36.DO 13.46,7.22 12.15,8.54 11.13,8.54 10.41,9.25 10.41,55.73 9.55,56.59 8.59,56.59 7.24,57.94 LED37.DI
N$39
  Top 0.203: LED37.DO 8.87,55.53 7.4,54.07 LED38.DI
N$40
  Top 0.203: LED38.DO 8.87,51.09 7.4,49.62 LED39.DI
N$41
  Top 0.203: LED39.DO 8.87,46.64 7.4,45.18 LED40.DI
N$42
  Top 0.203: LED40.DO 8.87,42.2 7.4,40.73 LED41.DI
N$43
  Top 0.203: LED42.DO 8.87,33.31 7.4,31.84 LED43.DI
N$44
  Top 0.203: LED43.DO 8.87,28.86 7.4,27.4 LED44.DI
N$45
  Top 0.203: LED44.DO 8.87,24.42 7.4,22.95 LED45.DI
N$46
  Top 0.203: LED45.DO 8.87,19.97 7.4,18.51 LED46.DI
N$47
  Top 0.203: LED46.DO 8.84,15.53 7.38,14.06 LED47.DI
N$48
  Top 0.203: LED47.DO 8.87,11.08 7.4,9.62 LED48.DI
N$49
  Top 0.203: LED48.DO 9.02,7.2 7.65,8.56 6.71,8.56 5.97,9.3 5.97,55.75 5.1,56.62 4.11,56.62 2.79,57.93 LED49.DI
N$50
  Top 0.203: LED49.DO 4.42,55.53 2.96,54.07 LED50.DI
N$51
  Top 0.203: LED50.DO 4.42,51.09 2.96,49.62 LED51.DI
N$52
  Top 0.203: LED51.DO 4.42,46.64 2.96,45.18 LED52.DI
N$53
  Top 0.203: LED52.DO 4.42,42.2 2.96,40.73 LED53.DI
N$54
  Top 0.203: LED53.DO 4.42,37.75 2.96,36.29 LED54.DI
N$55
  Top 0.203: LED54.DO 4.4,33.31 2.93,31.84 LED55.DI
N$56
  Top 0.203: LED55.DO 4.42,28.86 2.96,27.4 LED56.DI
N$57
  Top 0.203: LED56.DO 4.4,24.42 2.93,22.95 LED57.DI
N$58
  Top 0.203: LED57.DO 4.42,19.97 2.96,18.51 LED58.DI
N$59
  Top 0.203: LED58.DO 4.42,15.53 2.96,14.06 LED59.DI
N$60
  Top 0.203: LED59.DO 4.42,11.08 2.96,9.62 LED60.DI
N$143
  Top 0.305: R1.2 21.96,60.84 21.46,61.34 20.45,61.34 20.32,61.21 IC1.5

### Text on the board
tPlace: 5V | DI | GND | 2 | 3 | 4 | 5 | 6 | 7 | 8 | 9 | 10 | 11 | 12 | 13 | 14 | 15 | 16 | 17 | 18 | 19 | 20 | 21 | 22 | 23 | 24 | 25 | 26 | 27 | 28 | 29 | 30 | 31 | 32 | 33 | 34 | 35 | 36 | 37 | 38 | 39 | 40 | 5V | DO | GND
bPlace: GPIO21 | GPIO10 | GPIO18 | http://redscorp.net | (c) Andriy Golovnya | LED-zero35-SHIM v1.0 | BOTTOM SIDE